# Altium schematic sheet TPA2005D1_SingleEnded.SchDoc
size A4
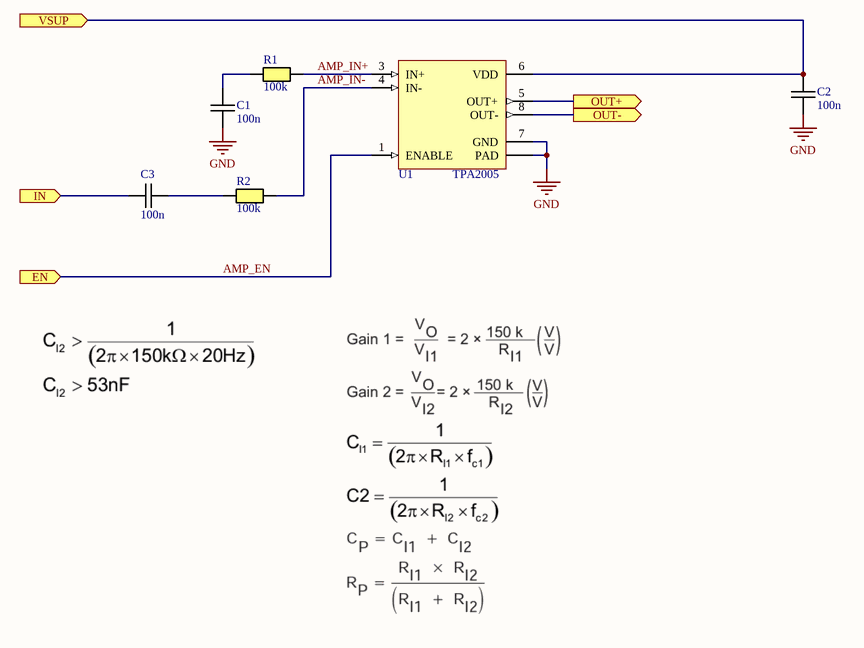
[diagram p0: TPA2005D1_SingleEnded.SchDoc]

## Parts
C1  100n  [CAPC0603(1608)55_N]
C2  100n  [CAPC0603(1608)55_N]
C3  100n  [CAPC0603(1608)55_N]
R1  100k  [RESC0603(1608)_N]
R2  100k  [RESC0603(1608)_N]
U1  TPA2005  [VSSOP8]

## Ports
EN (in), IN (in), OUT+ (out), OUT- (out), VSUP (in)

## Nets
GND: C1.2 C2.2 U1.7(GND) U1.PAD
AMP_EN: U1.1(ENABLE) ; port EN
AMP_IN+: R1.2 U1.3(IN+)
AMP_IN-: R2.2 U1.4(IN-)
IN: C3.1 ; port IN
OUT+: U1.5(OUT+) ; port OUT+
OUT-: U1.8(OUT-) ; port OUT-
VSUP: C2.1 U1.6(VDD) ; port VSUP
NetC1_1: C1.1 R1.1
NetC3_2: C3.2 R2.1

## Library data of the parts
C1-C3 = Capacitor M: Ceramic capacitor Medium density; Value: 100n
R1 R2 = Resistor M: Resistor Medium Density; Value: 100k
U1 = TPA2005: 1.4-W MONO Filter-Free Class-D Audio Power Amplifier